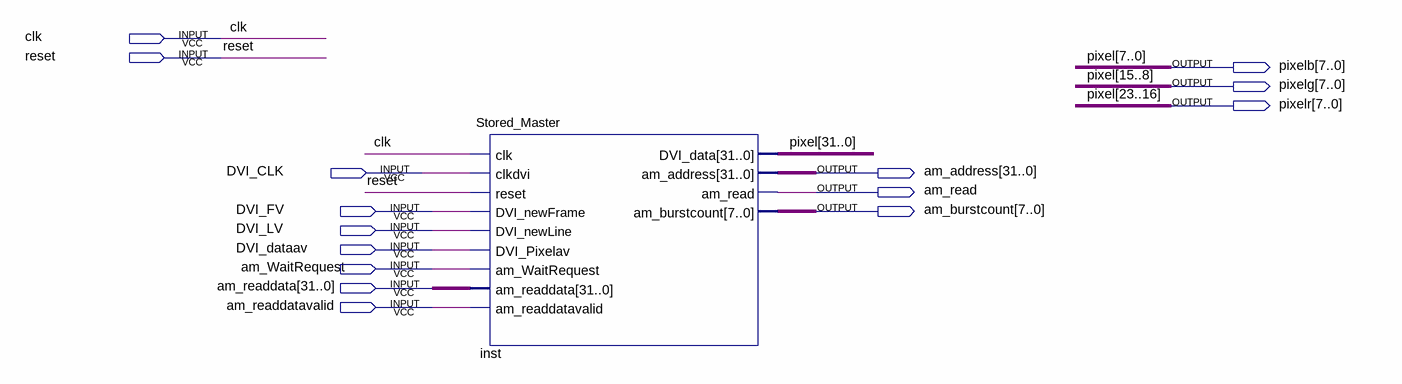
[diagram p0: schematic sheet]
// Quartus schematic Stored_Pixel_Interface_block.bdf as structural Verilog: 1 symbols, 15 pins
module Stored_Pixel_Interface_block (
  input  clk,
  input  reset,
  input  DVI_CLK,
  input  DVI_FV,
  input  DVI_LV,
  input  DVI_dataav,
  input  am_WaitRequest,
  input  [31:0] am_readdata,
  input  am_readdatavalid,
  output [7:0] pixelb,
  output [7:0] pixelg,
  output [7:0] pixelr,
  output [31:0] am_address,
  output am_read,
  output [7:0] am_burstcount
);

  wire [31:24] pixel;

  Stored_Master inst (
    .clk(clk), .clkdvi(DVI_CLK), .reset(reset), .DVI_newFrame(DVI_FV), .DVI_newLine(DVI_LV),
    .DVI_Pixelav(DVI_dataav), .am_WaitRequest(am_WaitRequest), .am_readdata(am_readdata),
    .am_readdatavalid(am_readdatavalid), .DVI_data({pixel, pixelr, pixelg, pixelb}), .am_address(am_address),
    .am_read(am_read), .am_burstcount(am_burstcount));

  // Other names for the same wires on the sheet: pixel[23:0] = {pixelr, pixelg, pixelb}
endmodule
